# EAGLE design thermal-stock (EAGLE 6.5.0)
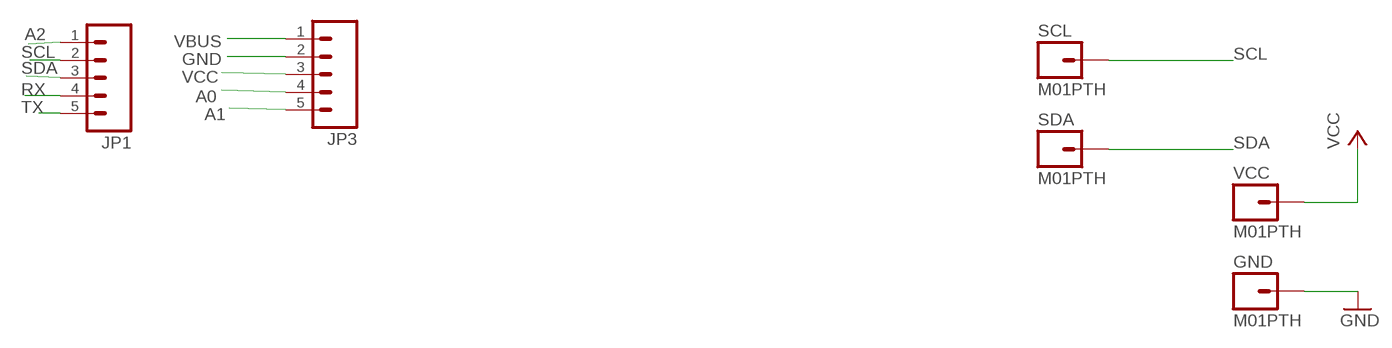
[diagram p0: schematic, sheet 1]

## Parts
GND  M01PTH  [1X01]
JP1  M05LOCK  [1X05_LOCK]
JP3  M05LOCK  [1X05_LOCK]
SCL  M01PTH  [1X01]
SDA  M01PTH  [1X01]
VCC  M01PTH  [1X01]

## Nets
A0: JP3.4
A1: JP3.5
A2: JP1.1
GND: GND.1 JP3.2
RX: JP1.4
SCL: JP1.2 SCL.1
SDA: JP1.3 SDA.1
TX: JP1.5
VBUS: JP3.1
VCC: JP3.3 VCC.1

## Library data of the parts
GND SCL SDA VCC = SparkFun-Connectors:M01: Header 1 Standard 1-pin 0.1" header. Use with straight break away headers (SKU : PRT-00116), right angle break away headers (PRT-00553), swiss pins (PRT-00743), machine pins (PRT-00117), and female headers (PRT-00115).
JP1 JP3 = SparkFun-Connectors:M05: Header 5 Standard 5-pin 0.1" header. Use with straight break away headers (SKU : PRT-00116), right angle break away headers (PRT-00553), swiss pins (PRT-00743), machine pins (PRT-00117), and female headers (PRT-00115). Molex polarized connector foot print use with SKU : PRT-08230 with associated crimp pins and housings.

## Board
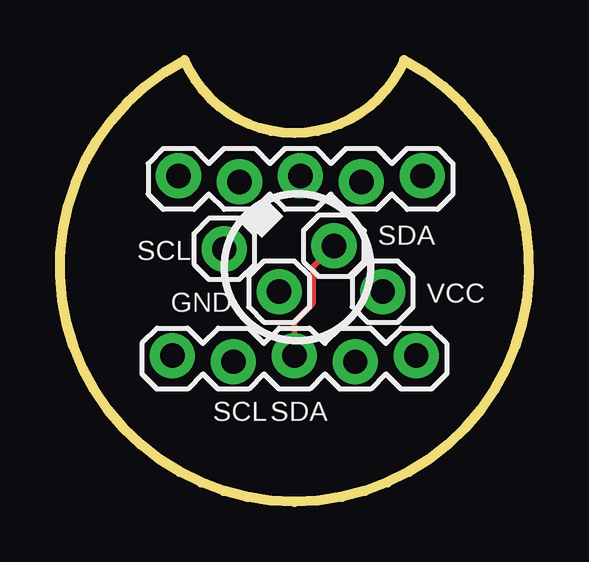
[diagram p1: board, top side]
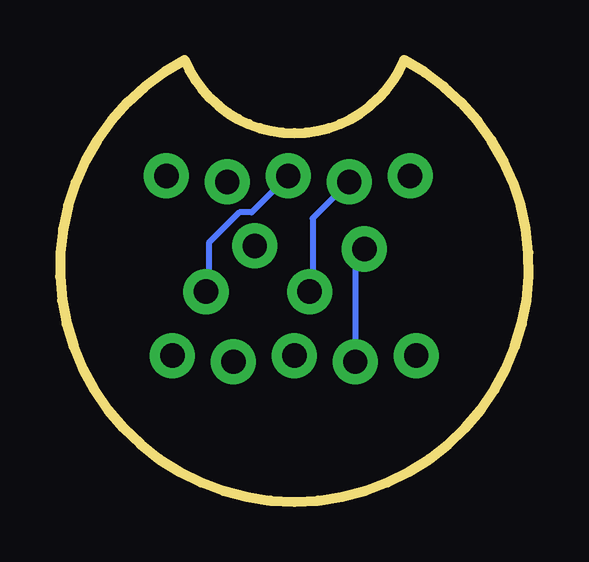
[diagram p2: board, bottom side, seen from below]

Size 19.53 x 18.41 mm. Coordinates in mm from the lower left corner, seen from the top.
Outline: 14.34,18.41 arc-135 5.19,18.41 arc304 14.34,18.41
Copper layers (1*16): Top 0.035mm / dielectric 1.5mm / Bottom 0.035mm
Design rules "default": minimum track width 10mil, minimum drill 24mil, track to track 8mil, track to pad 8mil, pad to pad 8mil, via to via 8mil, smd to smd 8mil, copper to edge 40mil, drill to drill 8mil, minimum pad ring 10mil, minimum via ring 8mil, stop-mask expansion 4mil, vias tented up to drill 0mil, thermal gap 10mil

### Footprints (pad centres in the part's own frame; a part is rotated, then mirrored left to right if it is on the bottom)
1X01 = drill 1.016 pad 1.88: 1 0,0
1X05_LOCK = drill 1.016 pad 1.88: 1 0,0.127; 2 2.54,-0.127; 3 5.08,0.127; 4 7.62,-0.127; 5 10.16,0.127

### Placement (x,y rotation side)
GND  9.13,8.76 0 top
JP1  4.68,5.96 0 top
JP3  4.94,13.45 0 top
SCL  6.84,10.53 0 top
SDA  11.42,10.66 0 top
VCC  13.45,8.76 0 top

### Tracks (layer width: path | path; a pad name or v marks a point on that pad's centre or on a via)
GND
  Bottom 0.254: JP3.2 9,11.8 9,8.76 GND.1
SCL
  Bottom 0.254: JP1.2 7.22,10.28 6.97,10.53 SCL.1
SDA
  Top 0.254: JP1.3 9.76,7.49 10.53,8.25 10.53,9.77 SDA.1
VCC
  Bottom 0.254: JP3.3 11.54,12.06 12.05,12.06 13.32,10.79 13.32,8.76 VCC.1

### Text on the board
tPlace: SCL | SDA